# EAGLE design Skaarhoj BI8-1x8CAP3slim (EAGLE 6.4)
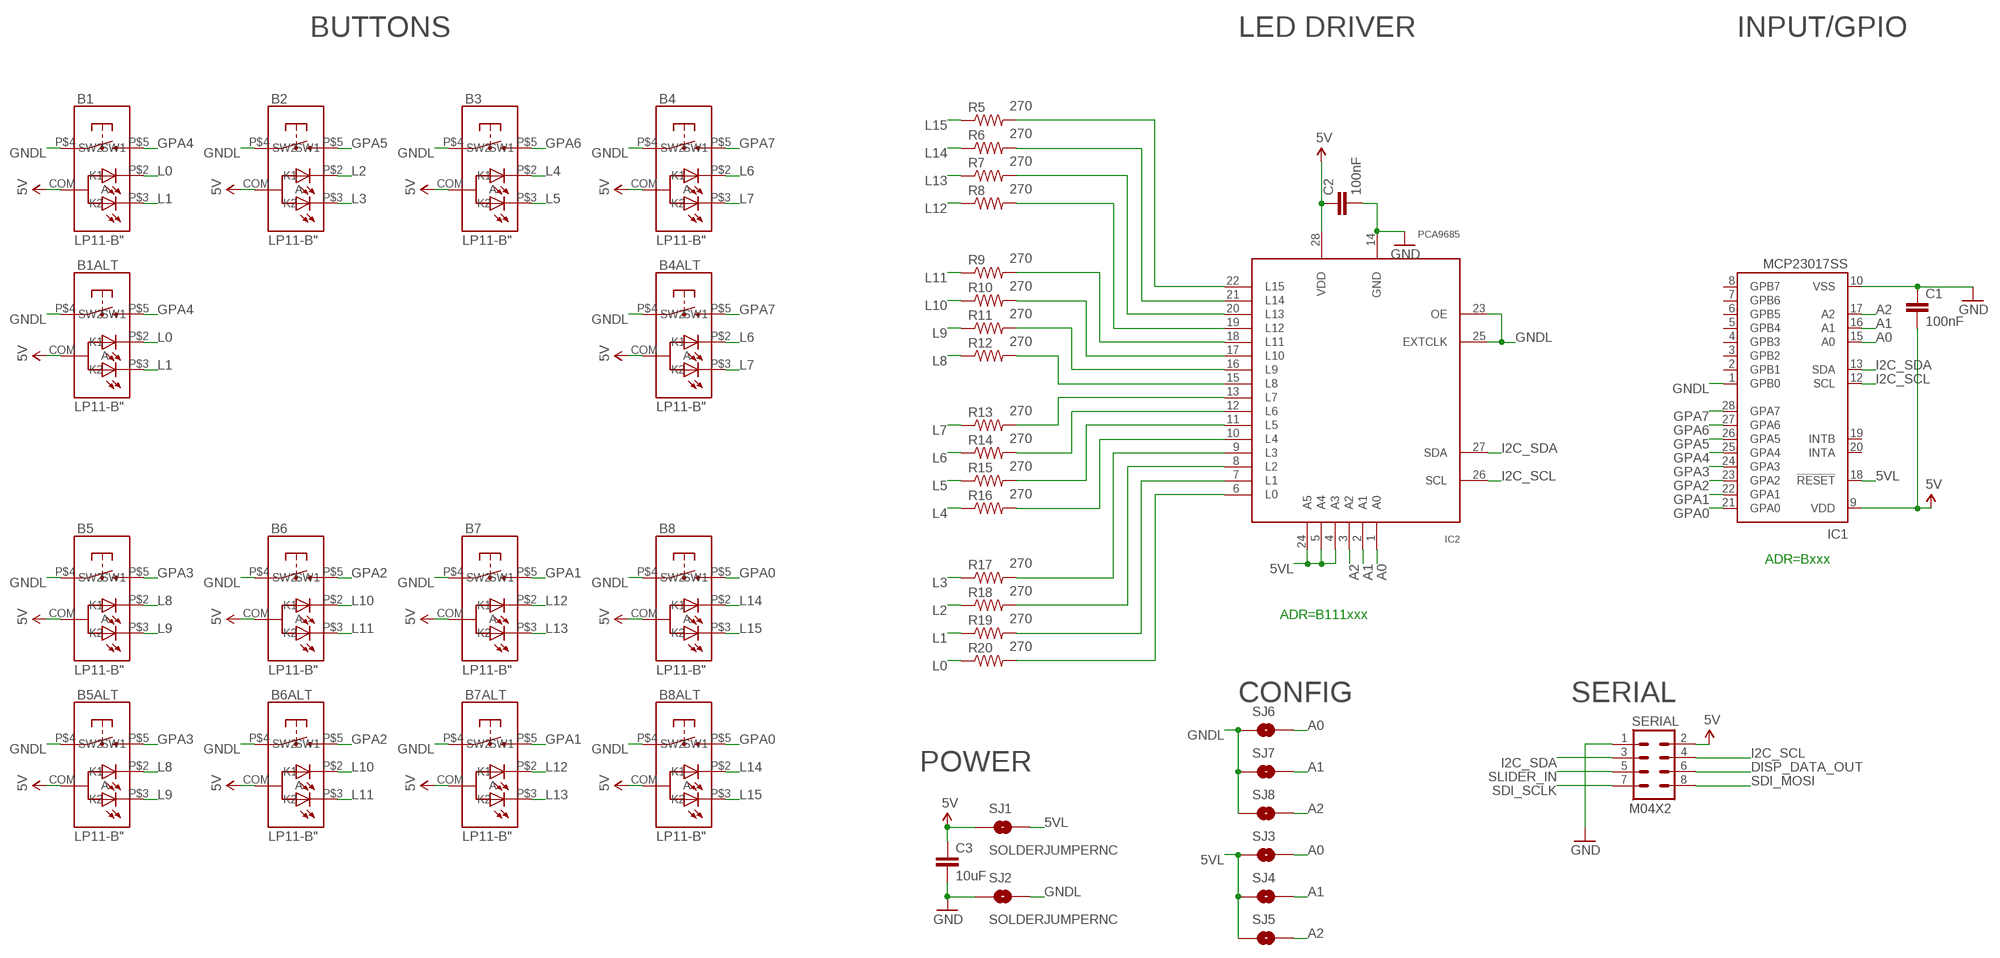
[diagram p0: schematic, sheet 1]

## Parts
B1  LP11-B"  [LP11]
B1ALT  LP11-B"  [LP11]
B2  LP11-B"  [LP11]
B3  LP11-B"  [LP11]
B4  LP11-B"  [LP11]
B4ALT  LP11-B"  [LP11]
B5  LP11-B"  [LP11]
B5ALT  LP11-B"  [LP11]
B6  LP11-B"  [LP11]
B6ALT  LP11-B"  [LP11]
B7  LP11-B"  [LP11]
B7ALT  LP11-B"  [LP11]
B8  LP11-B"  [LP11]
B8ALT  LP11-B"  [LP11]
C1  100nF  CAP0603-CAP  [0603-CAP]
C2  100nF  CAP0603-CAP  [0603-CAP]
C3  10uF  CAP0805  [0805]
IC1  MCP23017SS  [SSOP28]
IC2  PCA9685  [TSSOP28]
R5  270  RESISTOR0603-RES  [0603-RES]
R6  270  RESISTOR0603-RES  [0603-RES]
R7  270  RESISTOR0603-RES  [0603-RES]
R8  270  RESISTOR0603-RES  [0603-RES]
R9  270  RESISTOR0603-RES  [0603-RES]
R10  270  RESISTOR0603-RES  [0603-RES]
R11  270  RESISTOR0603-RES  [0603-RES]
R12  270  RESISTOR0603-RES  [0603-RES]
R13  270  RESISTOR0603-RES  [0603-RES]
R14  270  RESISTOR0603-RES  [0603-RES]
R15  270  RESISTOR0603-RES  [0603-RES]
R16  270  RESISTOR0603-RES  [0603-RES]
R17  270  RESISTOR0603-RES  [0603-RES]
R18  270  RESISTOR0603-RES  [0603-RES]
R19  270  RESISTOR0603-RES  [0603-RES]
R20  270  RESISTOR0603-RES  [0603-RES]
SERIAL  M04X2  [2X4]
SJ1  SOLDERJUMPERNC  [SJ_2S]
SJ2  SOLDERJUMPERNC  [SJ_2S]
SJ3  SOLDERJUMPERNC  [SJ_2S]
SJ4  SOLDERJUMPERNC  [SJ_2S]
SJ5  SOLDERJUMPERNC  [SJ_2S]
SJ6  SOLDERJUMPERNC  [SJ_2S]
SJ7  SOLDERJUMPERNC  [SJ_2S]
SJ8  SOLDERJUMPERNC  [SJ_2S]

## Nets
5V [Power]: B1.COM(A) B1ALT.COM(A) B2.COM(A) B3.COM(A) B4.COM(A) B4ALT.COM(A) B5.COM(A) B5ALT.COM(A) B6.COM(A) B6ALT.COM(A) B7.COM(A) B7ALT.COM(A) B8.COM(A) B8ALT.COM(A) C1.2 C2.1 C3.1 IC1.9(VDD) IC2.28(VDD) SERIAL.2 SJ1.1
5VL: IC1.18(!RESET) IC2.4(A3) IC2.5(A4) IC2.24(A5) SJ1.2 SJ3.1 SJ4.1 SJ5.1
A0: IC1.15(A0) IC2.1(A0) SJ3.2 SJ6.2
A1: IC1.16(A1) IC2.2(A1) SJ4.2 SJ7.2
A2: IC1.17(A2) IC2.3(A2) SJ5.2 SJ8.2
DISP_DATA_OUT: SERIAL.6
GND [Power]: C1.1 C2.2 C3.2 IC1.10(VSS) IC2.14(GND) SERIAL.1 SJ2.1
GNDL: B1.P$4(SW1) B1ALT.P$4(SW1) B2.P$4(SW1) B3.P$4(SW1) B4.P$4(SW1) B4ALT.P$4(SW1) B5.P$4(SW1) B5ALT.P$4(SW1) B6.P$4(SW1) B6ALT.P$4(SW1) B7.P$4(SW1) B7ALT.P$4(SW1) B8.P$4(SW1) B8ALT.P$4(SW1) IC1.1(GPB0) IC2.23(OE) IC2.25(EXTCLK) SJ2.2 SJ6.1 SJ7.1 SJ8.1
GPA0: B8.P$5(SW2) B8ALT.P$5(SW2) IC1.21(GPA0)
GPA1: B7.P$5(SW2) B7ALT.P$5(SW2) IC1.22(GPA1)
GPA2: B6.P$5(SW2) B6ALT.P$5(SW2) IC1.23(GPA2)
GPA3: B5.P$5(SW2) B5ALT.P$5(SW2) IC1.24(GPA3)
GPA4: B1.P$5(SW2) B1ALT.P$5(SW2) IC1.25(GPA4)
GPA5: B2.P$5(SW2) IC1.26(GPA5)
GPA6: B3.P$5(SW2) IC1.27(GPA6)
GPA7: B4.P$5(SW2) B4ALT.P$5(SW2) IC1.28(GPA7)
I2C_SCL: IC1.12(SCL) IC2.26(SCL) SERIAL.4
I2C_SDA: IC1.13(SDA) IC2.27(SDA) SERIAL.3
L0: B1.P$2(K1) B1ALT.P$2(K1) R20.1
L1: B1.P$3(K2) B1ALT.P$3(K2) R19.1
L2: B2.P$2(K1) R18.1
L3: B2.P$3(K2) R17.1
L4: B3.P$2(K1) R16.1
L5: B3.P$3(K2) R15.1
L6: B4.P$2(K1) B4ALT.P$2(K1) R14.1
L7: B4.P$3(K2) B4ALT.P$3(K2) R13.1
L8: B5.P$2(K1) B5ALT.P$2(K1) R12.1
L9: B5.P$3(K2) B5ALT.P$3(K2) R11.1
L10: B6.P$2(K1) B6ALT.P$2(K1) R10.1
L11: B6.P$3(K2) B6ALT.P$3(K2) R9.1
L12: B7.P$2(K1) B7ALT.P$2(K1) R8.1
L13: B7.P$3(K2) B7ALT.P$3(K2) R7.1
L14: B8.P$2(K1) B8ALT.P$2(K1) R6.1
L15: B8.P$3(K2) B8ALT.P$3(K2) R5.1
N$4: IC2.13(L7) R13.2
N$5: IC2.12(L6) R14.2
N$7: IC2.11(L5) R15.2
N$9: IC2.10(L4) R16.2
N$10: IC2.9(L3) R17.2
N$11: IC2.8(L2) R18.2
N$12: IC2.7(L1) R19.2
N$19: IC2.6(L0) R20.2
N$20: IC2.15(L8) R12.2
N$21: IC2.16(L9) R11.2
N$22: IC2.17(L10) R10.2
N$23: IC2.18(L11) R9.2
N$24: IC2.19(L12) R8.2
N$25: IC2.20(L13) R7.2
N$26: IC2.21(L14) R6.2
N$27: IC2.22(L15) R5.2
SDI_MOSI: SERIAL.8
SDI_SCLK: SERIAL.7
SLIDER_IN: SERIAL.5
Unconnected: IC1.2(GPB1) IC1.3(GPB2) IC1.4(GPB3) IC1.5(GPB4) IC1.6(GPB5) IC1.7(GPB6) IC1.8(GPB7) IC1.19(INTB) IC1.20(INTA)

## Notes on the sheet
- BUTTONS | LED DRIVER | INPUT/GPIO
- ADR=Bxxx
- ADR=B111xxx
- CONFIG | SERIAL
- POWER

## Library data of the parts
B1 B1ALT B2-B4 B4ALT B5 B5ALT B6 B6ALT B7 B7ALT B8 B8ALT = SKAARHOJ:LP11-B
C1-C3 = SparkFun:CAP: Capacitor Standard 0603 ceramic capacitor, and 0.1" leaded capacitor.
IC1 = microchip:MCP23017: http://ww1.microchip.com/downloads/en/DeviceDoc/21952a.pdf Source: http://ww1.microchip.com/downloads/en/DeviceDoc/21952a.pdf; MF: MICROCHIP; MPN: MCP23017-E/SS; OC_FARNELL: 1467674; OC_NEWARK: 31K2960
IC2 = wsmith:PCA9685
R5-R20 = SparkFun:RESISTOR: Resistor Basic schematic elements and footprints for 0603, 1206, and PTH resistors.
SERIAL = SparkFun:M04X2
SJ1-SJ8 = SparkFun:SOLDERJUMPER: Solder Jumper Standard SMD solder jumper. Used to automate production. Two varients : Normally Open and Normally Closed are the same, but have different paste layers. NC will have a large amount of paste and should jumper during reflow.

## Net classes
0 default: width 0.152 mm, drill 0.406 mm, clearance 0.152 mm
1 Power: width 0.406 mm, drill 0.61 mm, clearance 0.152 mm

## Board
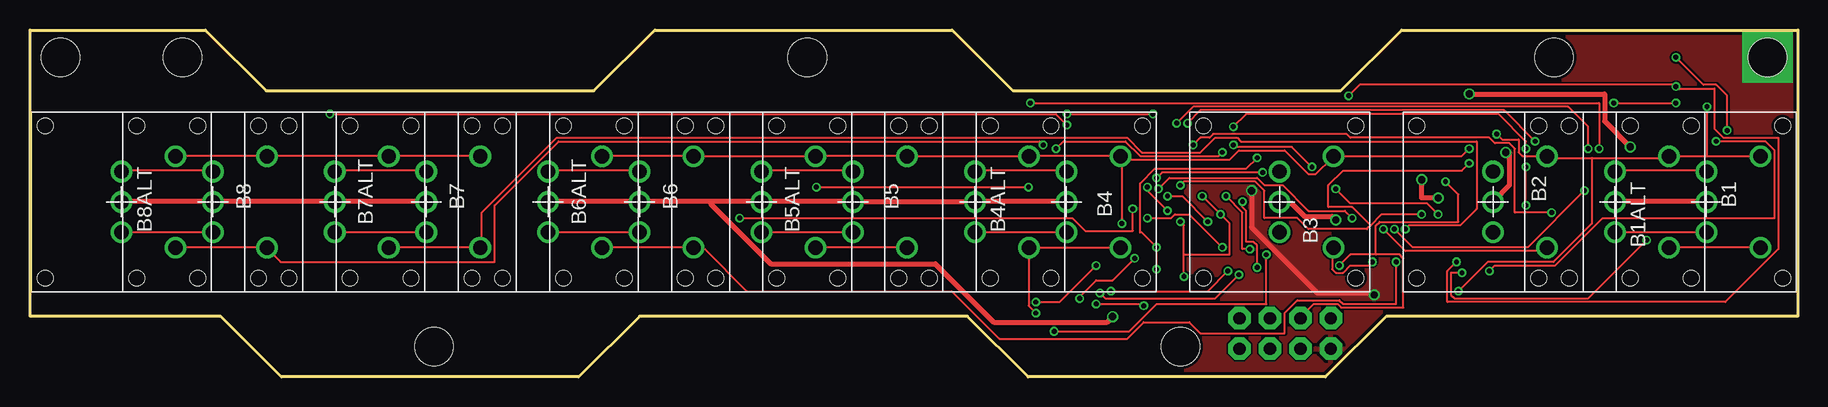
[diagram p1: board, top side]
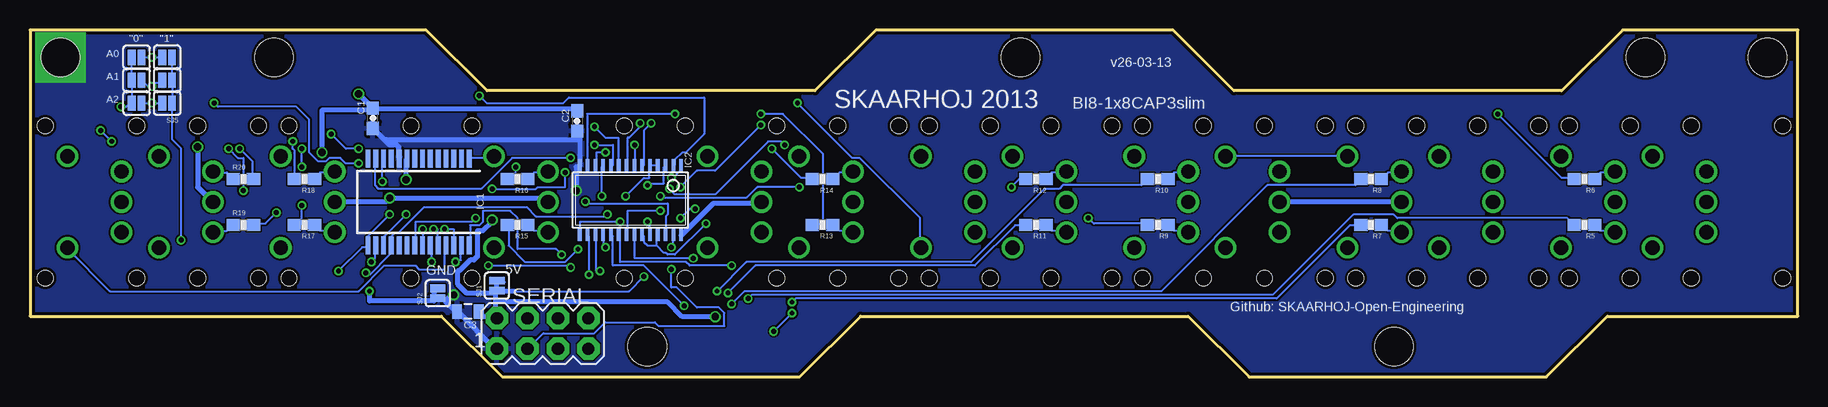
[diagram p2: board, bottom side, seen from below]

Size 147.32 x 28.96 mm. Coordinates in mm from the lower left corner, seen from the top.
Outline: 0,28.96 14.61,28.96 19.68,23.88 46.99,23.88 52.07,28.96 76.83,28.96 81.92,23.88 109.22,23.88 114.3,28.96 147.32,28.96 147.32,5.08 113.03,5.08 107.95,0 83.19,0 78.11,5.08 50.8,5.08 45.72,0 20.95,0 15.88,5.08 0,5.08 0,28.96
Copper layers (1*16): Top 0.035mm / dielectric 1.5mm / Bottom 0.035mm
Design rules "Fusion_eagle_rule_v1.1": minimum track width 6mil, minimum drill 12mil, track to track 6mil, track to pad 6mil, pad to pad 6mil, via to via 6mil, smd to smd 0mil, copper to edge 10mil, drill to drill 10mil, minimum pad ring 10mil, minimum via ring 6mil, stop-mask expansion 2mil, vias tented up to drill 100mil, thermal gap 10mil
Holes 3.2 mm at 2.54,26.67 33.66,2.54 95.89,2.54 64.77,26.67 127,26.67 12.7,26.67 144.78,26.67

### Footprints (pad centres in the part's own frame; a part is rotated, then mirrored left to right if it is on the bottom)
LP11 = drill 1.2: COM 0,0; P$2 0,2.54; P$3 0,-2.54; P$4 4.5,3.81; P$5 4.5,-3.81 | hole 1.3: -6.35,6.35; 6.35,6.35; 6.35,-6.35; -6.35,-6.35
0603-CAP = smd 1.1 x 1: 1 -0.85,0; 2 0.85,0
0805 = smd 0.8 x 1.2: 1 -0.9,0; 2 0.9,0
SSOP28 = smd 0.4 x 1.5: 1 -4.225,-3.625; 2 -3.575,-3.625; 3 -2.925,-3.625; 4 -2.275,-3.625; 5 -1.625,-3.625; 6 -0.975,-3.625; 7 -0.325,-3.625; 8 0.325,-3.625; 9 0.975,-3.625; 10 1.625,-3.625; 11 2.275,-3.625; 12 2.925,-3.625; 13 3.575,-3.625; 14 4.225,-3.625; 15 4.225,3.625; 16 3.575,3.625; 17 2.925,3.625; 18 2.275,3.625; 19 1.625,3.625; 20 0.975,3.625; 21 0.325,3.625; 22 -0.325,3.625; 23 -0.975,3.625; 24 -1.625,3.625; 25 -2.275,3.625; 26 -2.925,3.625; 27 -3.575,3.625; 28 -4.225,3.625
TSSOP28 = smd 0.305 x 0.991: 1 -4.225,-2.918; 2 -3.575,-2.918; 3 -2.925,-2.918; 4 -2.275,-2.918; 5 -1.625,-2.918; 6 -0.975,-2.918; 7 -0.325,-2.918; 8 0.325,-2.918; 9 0.975,-2.918; 10 1.625,-2.918; 11 2.275,-2.918; 12 2.925,-2.918; 13 3.575,-2.918; 14 4.225,-2.918; 15 4.225,2.918; 16 3.575,2.918; 17 2.925,2.918; 18 2.275,2.918; 19 1.625,2.918; 20 0.975,2.918; 21 0.325,2.918; 22 -0.325,2.918; 23 -0.975,2.918; 24 -1.625,2.918; 25 -2.275,2.918; 26 -2.925,2.918; 27 -3.575,2.918; 28 -4.225,2.918
0603-RES = smd 1.1 x 1: 1 -0.85,0; 2 0.85,0
2X4 = drill 1.016 pad 1.88 octagon: 1 -3.81,-1.27; 2 -3.81,1.27; 3 -1.27,-1.27; 4 -1.27,1.27; 5 1.27,-1.27; 6 1.27,1.27; 7 3.81,-1.27; 8 3.81,1.27
SJ_2S = smd 0.635 x 1.27: 1 -0.412,0; 2 0.412,0

### Placement (x,y rotation side)
B1  139.7,14.61 0 top
B1ALT  132.08,14.61 0 top
B2  121.92,14.61 0 top
B3  104.14,14.61 0 top
B4  86.36,14.61 0 top
B4ALT  78.74,14.61 0 top
B5  68.58,14.61 0 top
B5ALT  60.96,14.61 0 top
B6  50.8,14.61 0 top
B6ALT  43.18,14.61 0 top
B7  33.02,14.61 0 top
B7ALT  25.4,14.61 0 top
B8  15.24,14.61 0 top
B8ALT  7.62,14.61 0 top
C1  118.75,21.59 90 bottom
C2  101.73,21.36 270 bottom
C3  110.82,5.46 180 bottom
IC1  114.94,14.61 180 bottom
IC2  97.28,14.76 180 bottom
R5  17.78,12.7 180 bottom
R6  17.78,16.51 180 bottom
R7  35.56,12.7 180 bottom
R8  35.56,16.51 180 bottom
R9  53.34,12.7 180 bottom
R10  53.34,16.51 180 bottom
R11  63.5,12.7 180 bottom
R12  63.5,16.51 180 bottom
R13  81.28,12.7 180 bottom
R14  81.28,16.51 180 bottom
R15  106.68,12.7 180 bottom
R16  106.68,16.51 180 bottom
R17  124.46,12.7 180 bottom
R18  124.46,16.51 180 bottom
R19  129.54,12.7 0 bottom
R20  129.54,16.51 0 bottom
SERIAL  104.6,3.63 0 bottom
SJ1  108.41,7.62 90 bottom
SJ2  113.33,6.99 90 bottom
SJ3  135.89,26.67 180 bottom
SJ4  135.89,24.77 180 bottom
SJ5  135.89,22.86 180 bottom
SJ6  138.43,26.67 0 bottom
SJ7  138.43,24.77 0 bottom
SJ8  138.43,22.86 0 bottom

### Tracks (layer width: path | path; a pad name or v marks a point on that pad's centre or on a via)
5V  (via drill 0.61)
  Top 0.406: v115.98,16.46 115.98,14.94 v117.35,14.94 | v108.81,13.11 108.51,13.41 106.22,13.41 105.16,14.48 104.24,14.48 B3.COM | B1ALT.COM 132.13,14.63 139.6,14.63 B1.COM | v133.35,19.2 131.22,21.34 131.22,23.62 v119.94,23.62 | v122.99,18.75 123.29,18.75 123.29,16 121.92,14.63 B2.COM | B8ALT.COM 7.62,14.63 15.24,14.63 B8.COM 15.39,14.63 25.3,14.63 B7ALT.COM 25.45,14.63 32.92,14.63 B7.COM | B4.COM 86.26,14.63 78.79,14.63 B4ALT.COM 78.64,14.63 68.73,14.63 B5.COM 68.58,14.63 60.96,14.63 B5ALT.COM 60.81,14.63 56.69,14.63 | B6ALT.COM 43.28,14.63 50.75,14.63 B6.COM 50.9,14.63 56.69,14.63 | v90.22,5.03 89.76,4.57 80.31,4.57 75.44,9.45 61.72,9.45 56.69,14.48 56.69,14.63
  Bottom 0.406: C3.1 109.88,5.33 109.58,5.03 108.51,5.03 SERIAL.2 108.51,5.18 108.51,6.25 | 108.51,6.25 108.51,7.16 SJ1.1 108.66,7.01 110.95,7.01 111.71,7.77 111.71,8.84 111.56,8.84 110.64,9.75 110.34,9.75 110.03,10.06 110.03,12.19 109.58,12.19 108.81,12.95 v108.81,13.11 | v115.98,16.46 115.98,18.14 IC1.9 | B2.COM 121.92,14.63 117.65,14.63 v117.35,14.94 104.55,14.94 104.24,14.63 B3.COM | C2.1 101.8,22.25 101.96,22.4 118.72,22.4 C1.2 | v133.35,19.2 133.35,15.85 132.13,14.63 B1ALT.COM | v119.94,23.62 118.87,22.55 C1.2 | v122.99,18.75 122.99,22.25 118.72,22.25 C1.2 | IC2.28 92.96,11.89 90.37,14.48 86.41,14.48 B4.COM | B7.COM 33.07,14.63 43.13,14.63 B6ALT.COM | 108.51,6.25 94.18,6.25 92.96,5.03 v90.22,5.03
5VL  (via drill 0.41)
  Top 0.152: v134.72,11.43 129.84,6.55 118.72,6.55 118.42,6.86 118.42,8.69 v119.33,8.69 | v95.86,12.95 96.16,12.65 96.16,10.21 | v96.16,8.38 96.16,10.21 | v97.69,15.09 v99.21,13.56 99.97,12.8 99.97,10.21 96.16,10.21
  Bottom 0.152: IC2.4 95.1,17.68 95.56,17.68 IC2.5 95.71,17.53 95.71,16.61 96.16,16.61 v97.69,15.09 | SJ5.1 135.48,24.69 SJ4.1 135.48,24.84 SJ3.1 | SJ5.1 135.48,19.81 134.72,19.05 v134.72,11.43 | v119.33,8.69 119.18,8.53 119.02,8.53 117.35,10.21 117.35,10.97 IC1.18 117.2,11.12 117.2,11.73 116.89,12.04 116.59,12.04 114.45,14.17 105.92,14.17 105.16,13.41 99.36,13.41 v99.21,13.56 | SJ5.1 | v95.86,12.95 95.71,12.95 95.71,11.89 IC2.24 | v96.16,8.38 97.38,7.16 106.98,7.16 | 107.75,7.92 108.36,7.92 SJ1.2
  Bottom 0.406: 106.98,7.16 108.41,7.16 SJ1.2
A0  (via drill 0.41)
  Top 0.152: v93.88,16.61 94.34,17.07 v102.72,17.07 | v108.81,15.7 110.03,14.48 116.43,14.48 v117.35,13.56 | v137.16,26.67 139.45,24.38 140.51,24.38 141.43,23.47 v141.43,20.57 | v140.51,19.66 144.63,19.66 145.39,18.9 145.39,13.26 131.06,13.26 127.1,9.3 122.07,9.3 v121.61,8.84
  Bottom 0.152: SJ6.2 v137.16,26.67 SJ3.2 | v93.88,16.61 93.73,16.61 93.12,17.22 93.12,17.53 IC2.1 | v102.72,17.07 102.72,15.85 105,15.85 105.16,15.7 v108.81,15.7 | v117.35,13.56 119.18,11.73 119.18,11.12 IC1.15 119.02,10.97 119.18,10.82 119.63,10.82 v121.61,8.84 | v140.51,19.66 v141.43,20.57
A1  (via drill 0.41)
  Top 0.152: v109.88,23.47 110.8,24.38 137.01,24.38 v137.16,24.23 137.31,24.08 140.36,24.08 140.36,20.73 141.12,19.96 145.69,19.96 145.69,10.67 141.28,6.25 118.11,6.25 118.11,8.84 v118.87,9.6
  Bottom 0.152: v109.88,23.47 109.27,22.86 102.87,22.86 102.41,23.32 91.14,23.32 91.14,20.27 92.66,18.75 92.96,18.75 93.57,18.14 93.57,17.68 IC2.2 | SJ4.2 136.25,24.69 136.4,24.54 136.85,24.54 v137.16,24.23 137.47,24.23 137.92,24.69 SJ7.2 | v118.87,9.6 118.57,9.91 118.57,10.97 IC1.16
A2  (via drill 0.41)
  Top 0.152: v95.86,16 96.16,16.31 102.11,16.31 102.87,15.54 102.87,13.26 105.61,13.26 106.53,12.34 111.4,12.34 111.71,12.65 | 111.71,12.65 112.62,13.56 v115.98,13.56 | v131.98,22.86 v137.16,22.86 | v119.94,17.83 119.33,17.22 109.42,17.22 108.2,16 108.2,14.17 110.19,14.17 111.71,12.65
  Bottom 0.152: v95.86,16 95.71,16.15 94.49,16.15 94.49,17.53 IC2.3 | v115.98,13.56 117.81,11.73 117.81,11.12 IC1.17 | SJ8.2 v137.16,22.86 SJ5.2 | v131.98,22.86 131.67,22.55 125.12,22.55 124.05,21.49 124.05,18.75 123.29,17.98 122.68,17.98 122.38,18.29 121.46,18.29 121.01,17.83 v119.94,17.83
GND  (via drill 0.61, 3.2)
  Top 0.406: v112.01,6.86 111.86,7.01 107.29,7.01 101.8,12.5 v101.8,15.54
  Bottom 0.406: 112.7,6.33 112.93,6.55 113.23,6.55 SJ2.1 | 112.7,6.33 111.86,5.49 C3.2 111.56,5.33 108.66,2.44 108.51,2.44 SERIAL.1 | 101.5,19.81 101.5,20.42 101.65,20.42 C2.2 | 101.5,19.81 101.5,17.68 IC2.14 101.65,17.53 101.8,17.53 v101.8,15.54 | 117.73,19.74 117.35,19.36 116.74,19.36 116.59,19.2 116.59,18.29 IC1.10 | 117.73,19.74 118.72,20.73 C1.1 | 101.5,19.81 117.65,19.81 117.73,19.74 | 112.7,6.33 112.17,6.86 v112.01,6.86
  other vias: 144.78,26.67
  pour Top: 0,0 147.32,0 147.32,29.21 0,29.21
  pour Bottom: 0,0 147.32,0 147.32,29.21 0,29.21
GNDL  (via drill 0.41)
  Top 0.152: v119.02,7.16 121.46,9.6 126.95,9.6 130.15,12.8 130.15,18.29 | 130.15,18.29 126.49,18.29 B2.P$4 126.34,18.44 124.36,18.44 124.05,18.75 124.05,19.81 122.68,19.81 v122.22,20.27 | 130.15,18.29 136.55,18.29 B1ALT.P$4 136.7,18.44 139.75,18.44 | 139.75,18.44 144.17,18.44 B1.P$4 | 90.98,18.14 90.98,18.29 B4.P$4 | 90.98,18.14 v90.98,12.8 | B4.P$4 90.83,18.44 83.36,18.44 B4ALT.P$4 83.21,18.44 73.15,18.44 B5.P$4 73,18.44 65.53,18.44 B5ALT.P$4 65.38,18.44 55.32,18.44 B6.P$4 55.17,18.44 47.7,18.44 B6ALT.P$4 | 90.98,18.14 99.97,18.14 100.74,18.9 104.55,18.9 106.53,16.92 107.14,16.92 108.51,18.29 B3.P$4 108.66,18.44 119.33,18.44 v119.94,19.05 | 90.98,18.14 B4.P$4 | B8ALT.P$4 12.19,18.44 19.66,18.44 B8.P$4 19.81,18.44 29.87,18.44 B7ALT.P$4 30.02,18.44 37.49,18.44 B7.P$4 | 139.75,18.44 v139.75,22.55
  Bottom 0.152: 113.54,7.16 113.39,7.32 SJ2.2 | IC1.1 110.64,18.29 108.66,18.29 B3.P$4 | 95.1,10.97 95.1,11.73 IC2.25 | 95.1,10.97 95.86,10.97 96.16,11.28 96.16,11.73 IC2.23 | 95.1,10.97 94.49,10.36 94.34,10.36 94.18,10.21 93.57,10.21 v90.98,12.8 | B6ALT.P$4 47.55,18.44 37.64,18.44 B7.P$4 | v122.22,20.27 121.01,19.05 v119.94,19.05 | SJ6.1 138.84,24.84 SJ7.1 138.84,24.69 SJ8.1 138.99,22.86 139.29,22.55 v139.75,22.55
  Bottom 0.406: 113.54,7.16 113.67,7.16 113.67,6.35 119.02,6.35 v119.02,7.16
GPA0  (via drill 0.41)
  Top 0.152: v110.19,13.26 109.58,13.87 106.53,13.87 104.39,16 102.87,16 102.26,16.61 94.94,16.61 v94.03,15.7 | v84.43,19.36 84.12,19.66 44.04,19.66 38.71,14.33 38.71,9.6 20.88,9.6 19.81,10.67 B8.P$5 19.66,10.82 12.19,10.82 B8ALT.P$5
  Bottom 0.152: v110.19,13.26 110.49,12.95 115.21,12.95 115.21,11.12 IC1.21 | v94.03,15.7 93.57,15.24 90.22,15.24 85.8,19.66 84.73,19.66 v84.43,19.36
GPA1  (via drill 0.41)
  Top 0.152: v114.61,12.34 114.91,12.65 119.18,12.65 120.55,14.02 120.55,19.66 100.89,19.66 100.58,19.96 98.75,19.96 97.54,18.75 92.66,18.75 91.44,19.96 43.89,19.96 37.64,13.72 37.64,10.82 B7.P$5 37.49,10.82 30.02,10.82 B7ALT.P$5
  Bottom 0.152: v114.61,12.34 114.61,11.12 IC1.22
GPA2  (via drill 0.41)
  Top 0.152: v113.84,9.6 113.84,6.1 109.42,6.1 109.12,6.4 105.61,6.4 104.55,5.33 104.55,3.66 97.54,3.66 96.62,4.57 92.81,4.57 91.44,3.2 80.77,3.2 76.81,7.16 59.74,7.16 56.24,10.67 55.32,10.67 B6.P$5 55.17,10.82 47.7,10.82 B6ALT.P$5
  Bottom 0.152: v113.84,9.6 113.84,10.97 IC1.23
GPA3  (via drill 0.41)
  Top 0.152: v113.69,12.34 115.21,10.82 124.82,10.82 v129.54,15.54 | v130.76,19.05 130.76,22.86 v83.36,22.86 | B5ALT.P$5 65.53,10.82 73,10.82 B5.P$5
  Bottom 0.152: v113.69,12.34 113.39,12.34 113.39,11.12 IC1.24 | v129.54,15.54 129.54,18.29 130,18.29 v130.76,19.05 | v83.36,22.86 78.79,18.29 78.18,18.29 73.15,13.26 73.15,10.82 B5.P$5
GPA4
  Top 0.152: B1ALT.P$5 136.7,10.82 144.17,10.82 B1.P$5
  Bottom 0.152: IC1.25 112.78,10.97 112.78,8.99 114.91,8.99 115.21,9.3 117.81,9.3 119.94,7.16 140.66,7.16 144.17,10.67 B1.P$5
GPA5  (via drill 0.41)
  Top 0.152: v112.78,12.34 114.61,10.52 126.19,10.52 126.34,10.67 B2.P$5
  Bottom 0.152: v112.78,12.34 112.01,12.34 112.01,11.12 IC1.26
GPA6  (via drill 0.41)
  Top 0.152: v111.86,9.6 111.56,9.3 110.03,9.3 109.42,8.69 108.81,8.69 108.51,8.99 108.51,10.67 B3.P$5
  Bottom 0.152: v111.86,9.6 111.71,9.75 111.4,9.75 111.4,10.97 IC1.27
GPA7  (via drill 0.41)
  Top 0.152: v103.02,10.21 103.02,6.1 93.88,6.1 91.59,3.81 v85.34,3.81 | v83.82,5.33 83.21,5.94 83.21,10.67 B4ALT.P$5 83.36,10.82 90.83,10.82 B4.P$5
  Bottom 0.152: v103.02,10.21 103.48,10.67 106.68,10.67 106.68,13.26 107.29,13.87 109.58,13.87 109.58,12.95 109.88,12.65 110.64,12.65 110.64,11.12 IC1.28 | v83.82,5.33 v85.34,3.81
I2C_SCL  (via drill 0.41)
  Top 0.152: v101.04,14.63 101.04,14.17 101.35,13.87 101.35,11.28 101.96,11.28 102.26,10.97 v102.26,9.14 | v109.12,9.3 110.03,10.21 112.17,10.21 | 112.17,10.21 114.15,10.21 114.45,9.91 114.45,5.79 109.27,5.79 108.97,6.1 106.98,6.1 105.92,5.03 SERIAL.4 | v117.96,16.31 119.02,15.24 119.02,12.95 112.47,12.95 112.17,12.65 112.17,10.21
  Bottom 0.152: v101.04,14.63 100.89,14.48 94.18,14.48 94.18,13.56 94.34,13.41 94.34,11.89 IC2.26 | v102.26,9.14 102.41,9.3 v109.12,9.3 | v117.96,16.31 117.96,18.14 IC1.12
I2C_SDA  (via drill 0.41)
  Top 0.152: v93.88,8.99 v93.88,10.82 92.66,12.04 92.51,12.04 92.51,16.15 93.73,17.37 101.35,17.37 v102.26,18.29
  Bottom 0.152: v93.88,10.82 93.73,10.82 93.73,11.73 IC2.27 | v93.88,8.99 93.88,7.47 93.42,7.47 91.75,5.79 89.92,5.79 89.46,5.33 89.46,4.27 94.94,4.27 95.25,4.57 99.36,4.57 100.28,3.66 104.55,3.66 105.77,2.44 SERIAL.3 | v102.26,18.29 107.14,18.29 109.73,15.7 118.26,15.7 118.57,16 118.57,18.14 IC1.13
L0
  Top 0.152: B1ALT.P$2 132.13,17.22 139.6,17.22 B1.P$2
  Bottom 0.152: R20.1 130.45,16.61 130.91,17.07 131.98,17.07 B1ALT.P$2
L1
  Top 0.152: B1ALT.P$3 132.13,12.04 139.6,12.04 B1.P$3
  Bottom 0.152: R19.1 130.45,12.65 130.91,12.19 131.98,12.19 B1ALT.P$3
L2
  Bottom 0.152: R18.1 123.6,16.61 123.14,17.07 121.92,17.07 B2.P$2
L3
  Bottom 0.152: R17.1 123.6,12.65 123.14,12.19 121.92,12.19 B2.P$3
L4
  Bottom 0.152: R16.1 105.77,16.61 105.31,17.07 104.24,17.07 B3.P$2
L5
  Bottom 0.152: R15.1 105.77,12.65 105.31,12.19 104.24,12.19 B3.P$3
L6
  Top 0.152: B4ALT.P$2 78.79,17.22 86.26,17.22 B4.P$2
  Bottom 0.152: R14.1 80.31,16.61 79.86,17.07 78.79,17.07 B4ALT.P$2
L7
  Top 0.152: B4ALT.P$3 78.79,12.04 86.26,12.04 B4.P$3
  Bottom 0.152: R13.1 80.31,12.65 79.86,12.19 78.79,12.19 B4ALT.P$3
L8
  Top 0.152: B5ALT.P$2 60.96,17.22 68.58,17.22 B5.P$2
  Bottom 0.152: R12.1 62.64,16.61 62.18,17.07 60.96,17.07 B5ALT.P$2
L9
  Top 0.152: B5ALT.P$3 60.96,12.04 68.58,12.04 B5.P$3
  Bottom 0.152: R11.1 62.64,12.65 62.18,12.19 60.96,12.19 B5ALT.P$3
L10
  Top 0.152: B6ALT.P$2 43.28,17.22 50.75,17.22 B6.P$2
  Bottom 0.152: R10.1 52.43,16.61 51.97,17.07 50.9,17.07 B6.P$2
L11
  Top 0.152: B6ALT.P$3 43.28,12.04 50.75,12.04 B6.P$3
  Bottom 0.152: R9.1 52.43,12.65 51.97,12.19 50.9,12.19 B6.P$3
L12
  Top 0.152: B7ALT.P$2 25.45,17.22 32.92,17.22 B7.P$2
  Bottom 0.152: R8.1 34.59,16.61 34.14,17.07 33.07,17.07 B7.P$2
L13
  Top 0.152: B7ALT.P$3 25.45,12.04 32.92,12.04 B7.P$3
  Bottom 0.152: R7.1 34.59,12.65 34.14,12.19 33.07,12.19 B7.P$3
L14
  Top 0.152: B8ALT.P$2 7.62,17.22 15.24,17.22 B8.P$2
  Bottom 0.152: R6.1 16.92,16.61 16.46,17.07 15.24,17.07 B8.P$2
L15
  Top 0.152: B8ALT.P$3 7.62,12.04 15.24,12.04 B8.P$3
  Bottom 0.152: R5.1 16.92,12.65 16.46,12.19 15.24,12.19 B8.P$3
N$4  (via drill 0.41)
  Top 0.152: v86.41,21.95 v93.57,21.95
  Bottom 0.152: v93.57,21.95 100.89,21.95 100.89,17.68 IC2.13 | v86.41,21.95 84.58,21.95 81.23,18.59 81.23,12.8 81.99,12.8 R13.2
N$5  (via drill 0.41)
  Top 0.152: v99.36,18.75 99.06,18.44 92.51,18.44 91.29,19.66 86.11,19.66 v85.5,19.05
  Bottom 0.152: v99.36,18.75 100.13,18.75 100.13,17.68 IC2.12 | v85.5,19.05 83.06,16.61 82.14,16.61 R14.2
N$7  (via drill 0.41)
  Top 0.152: v99.67,15.09 101.04,13.72 101.04,10.67 v101.65,10.67
  Bottom 0.152: v99.67,15.09 99.67,17.53 IC2.11 | v101.65,10.67 102.72,9.6 106.07,9.6 107.44,10.97 107.44,12.65 R15.2
N$9  (via drill 0.41)
  Top 0.152: v100.28,19.36 100.43,19.2 105.16,19.2 v106.83,17.53
  Bottom 0.152: v100.28,19.36 98.75,19.36 98.75,17.68 IC2.10 | v106.83,17.53 106.83,16.61 107.44,16.61 R16.2
N$10  (via drill 0.41)
  Top 0.152: v100.28,20.88 101.35,21.95 122.38,21.95 124.66,19.66 v124.66,19.05 | v124.66,14.33 v124.66,17.53
  Bottom 0.152: v100.28,20.88 99.36,19.96 98.3,19.96 98.3,17.68 IC2.9 | v124.66,17.53 v124.66,19.05 | v124.66,14.33 124.66,12.8 125.27,12.8 R17.2
N$11  (via drill 0.41)
  Top 0.152: v96.47,21.18 97.54,22.25 122.83,22.25 v125.42,19.66
  Bottom 0.152: v96.47,21.18 96.47,20.88 97.38,19.96 97.54,19.96 97.54,17.68 IC2.8 | v125.42,19.66 125.42,19.05 125.27,18.9 125.27,16.61 R18.2
N$12  (via drill 0.41)
  Top 0.152: v96.93,19.36 97.54,19.96 98.3,19.96 98.6,20.27 109.73,20.27 110.03,19.96 121.61,19.96 122.07,19.51 123.29,19.51 123.75,19.05 123.75,13.72 v126.8,13.72
  Bottom 0.152: v96.93,19.36 96.93,17.68 IC2.7 | v126.8,13.72 127.71,12.8 128.63,12.8 R19.2
N$19  (via drill 0.41)
  Top 0.152: v95.56,21.18 96.93,22.55 128.17,22.55 129.84,20.88 v129.84,19.05
  Bottom 0.152: v95.56,21.18 96.16,20.57 96.16,17.68 IC2.6 | v129.84,19.05 128.78,17.98 128.78,16.61 R20.2
N$20  (via drill 0.41)
  Top 0.152: v98.15,12.95 96.01,15.09 v94.79,15.09 | v65.53,15.85 v83.21,15.85
  Bottom 0.152: v98.15,12.95 101.5,12.95 101.5,11.89 IC2.15 | v94.79,15.09 94.64,14.94 87.63,14.94 86.72,15.85 v83.21,15.85 | v65.53,15.85 64.92,16.46 64.47,16.46 R12.2
N$21  (via drill 0.41)
  Top 0.152: v100.74,8.53 98.75,6.55 89.61,6.55 v89.15,7.01
  Bottom 0.152: v100.74,8.53 100.74,11.73 IC2.16 | v89.15,7.01 86.87,9.3 68.58,9.3 65.23,12.65 64.47,12.65 R11.2
N$22  (via drill 0.41)
  Top 0.152: v99.82,8.84 98.15,7.16 v90.07,7.16
  Bottom 0.152: v99.82,8.84 100.13,8.84 100.13,11.73 IC2.17 | v90.07,7.16 87.63,9.6 68.89,9.6 62.79,15.7 61.57,15.7 61.27,16 54.71,16 54.25,16.46 R10.2
N$23  (via drill 0.41)
  Top 0.152: v99.36,10.82 96.62,13.56 95.4,13.56 95.1,13.26 v93.12,13.26 | v91.9,14.02 91.9,12.19 87.94,12.19 86.87,13.26 v59.13,13.26
  Bottom 0.152: v99.36,10.82 99.52,10.82 99.52,11.73 IC2.18 | v93.12,13.26 92.35,14.02 v91.9,14.02 | v59.13,13.26 58.67,12.8 54.25,12.8 R9.2
N$24  (via drill 0.41)
  Top 0.152: v92.81,5.94 92.66,6.1 v88.85,6.1
  Bottom 0.152: v92.81,5.94 96.16,9.3 98.75,9.3 98.75,11.73 IC2.19 | v88.85,6.1 87.78,7.16 53.03,7.16 44.2,16 36.88,16 36.42,16.46 R8.2
N$25  (via drill 0.41)
  Top 0.152: v88.85,9.3 85.8,6.25 v83.82,6.25
  Bottom 0.152: v88.85,9.3 92.35,9.3 92.66,9.6 98.15,9.6 98.15,11.73 IC2.20 | v83.82,6.25 83.52,6.55 43.43,6.55 37.34,12.65 36.42,12.65 R7.2
N$26  (via drill 0.41)
  Top 0.152: v94.79,13.87 93.12,15.54 v93.12,15.85 | v86.41,21.03 85.5,21.95 v24.99,21.95
  Bottom 0.152: v94.79,13.87 97.54,13.87 97.54,11.89 IC2.21 | v93.12,15.85 91.75,17.22 90.22,17.22 v86.41,21.03 | v24.99,21.95 19.66,16.61 18.75,16.61 R6.2
N$27  (via drill 0.41)
  Top 0.152: v92.05,9.91 90.22,8.08 88.85,8.08 87.48,6.71 v87.48,6.55
  Bottom 0.152: v92.05,9.91 96.93,9.91 96.93,11.73 IC2.22 | v87.48,6.55 87.17,6.86 43.74,6.86 37.03,13.56 33.68,13.56 33.38,13.26 19.2,13.26 18.75,12.8 R5.2

### Text on the board
_bsilk: "1" | "0" | v26-03-13 | A0 | A1 | A2 | BI8-1x8CAP3slim | SKAARHOJ 2013 | 5V | GND | Github: SKAARHOJ-Open-Engineering | 1